# Altium schematic sheet USB_Hub.SchDoc: Apalis Evaluation Board 1.1
size A3; Organization: Toradex AG; Address1: Altsagenstrasse 5; Address2: Horw; Address3: 6048; Address4: Switzerland; DocumentNumber: 6; Revision: V1.1; SheetNumber: 6; SheetTotal: 32; PageSetup: Record=PageOptions|CenterHorizontal=True|CenterVertical=True|PrintScale=0.71|XCorrection=1.00|YCorrection=1.00|PrintKind=0|BorderSize=5000000|LeftOffset=0|BottomOffset=0|Orientation=2|PaperLength=1000|PaperWidth=1000|Scale=100|PaperSource=7|PrintQuality=-4|MediaType=1|DitherType=10|PaperKind=A4|PrintScaleMode=1
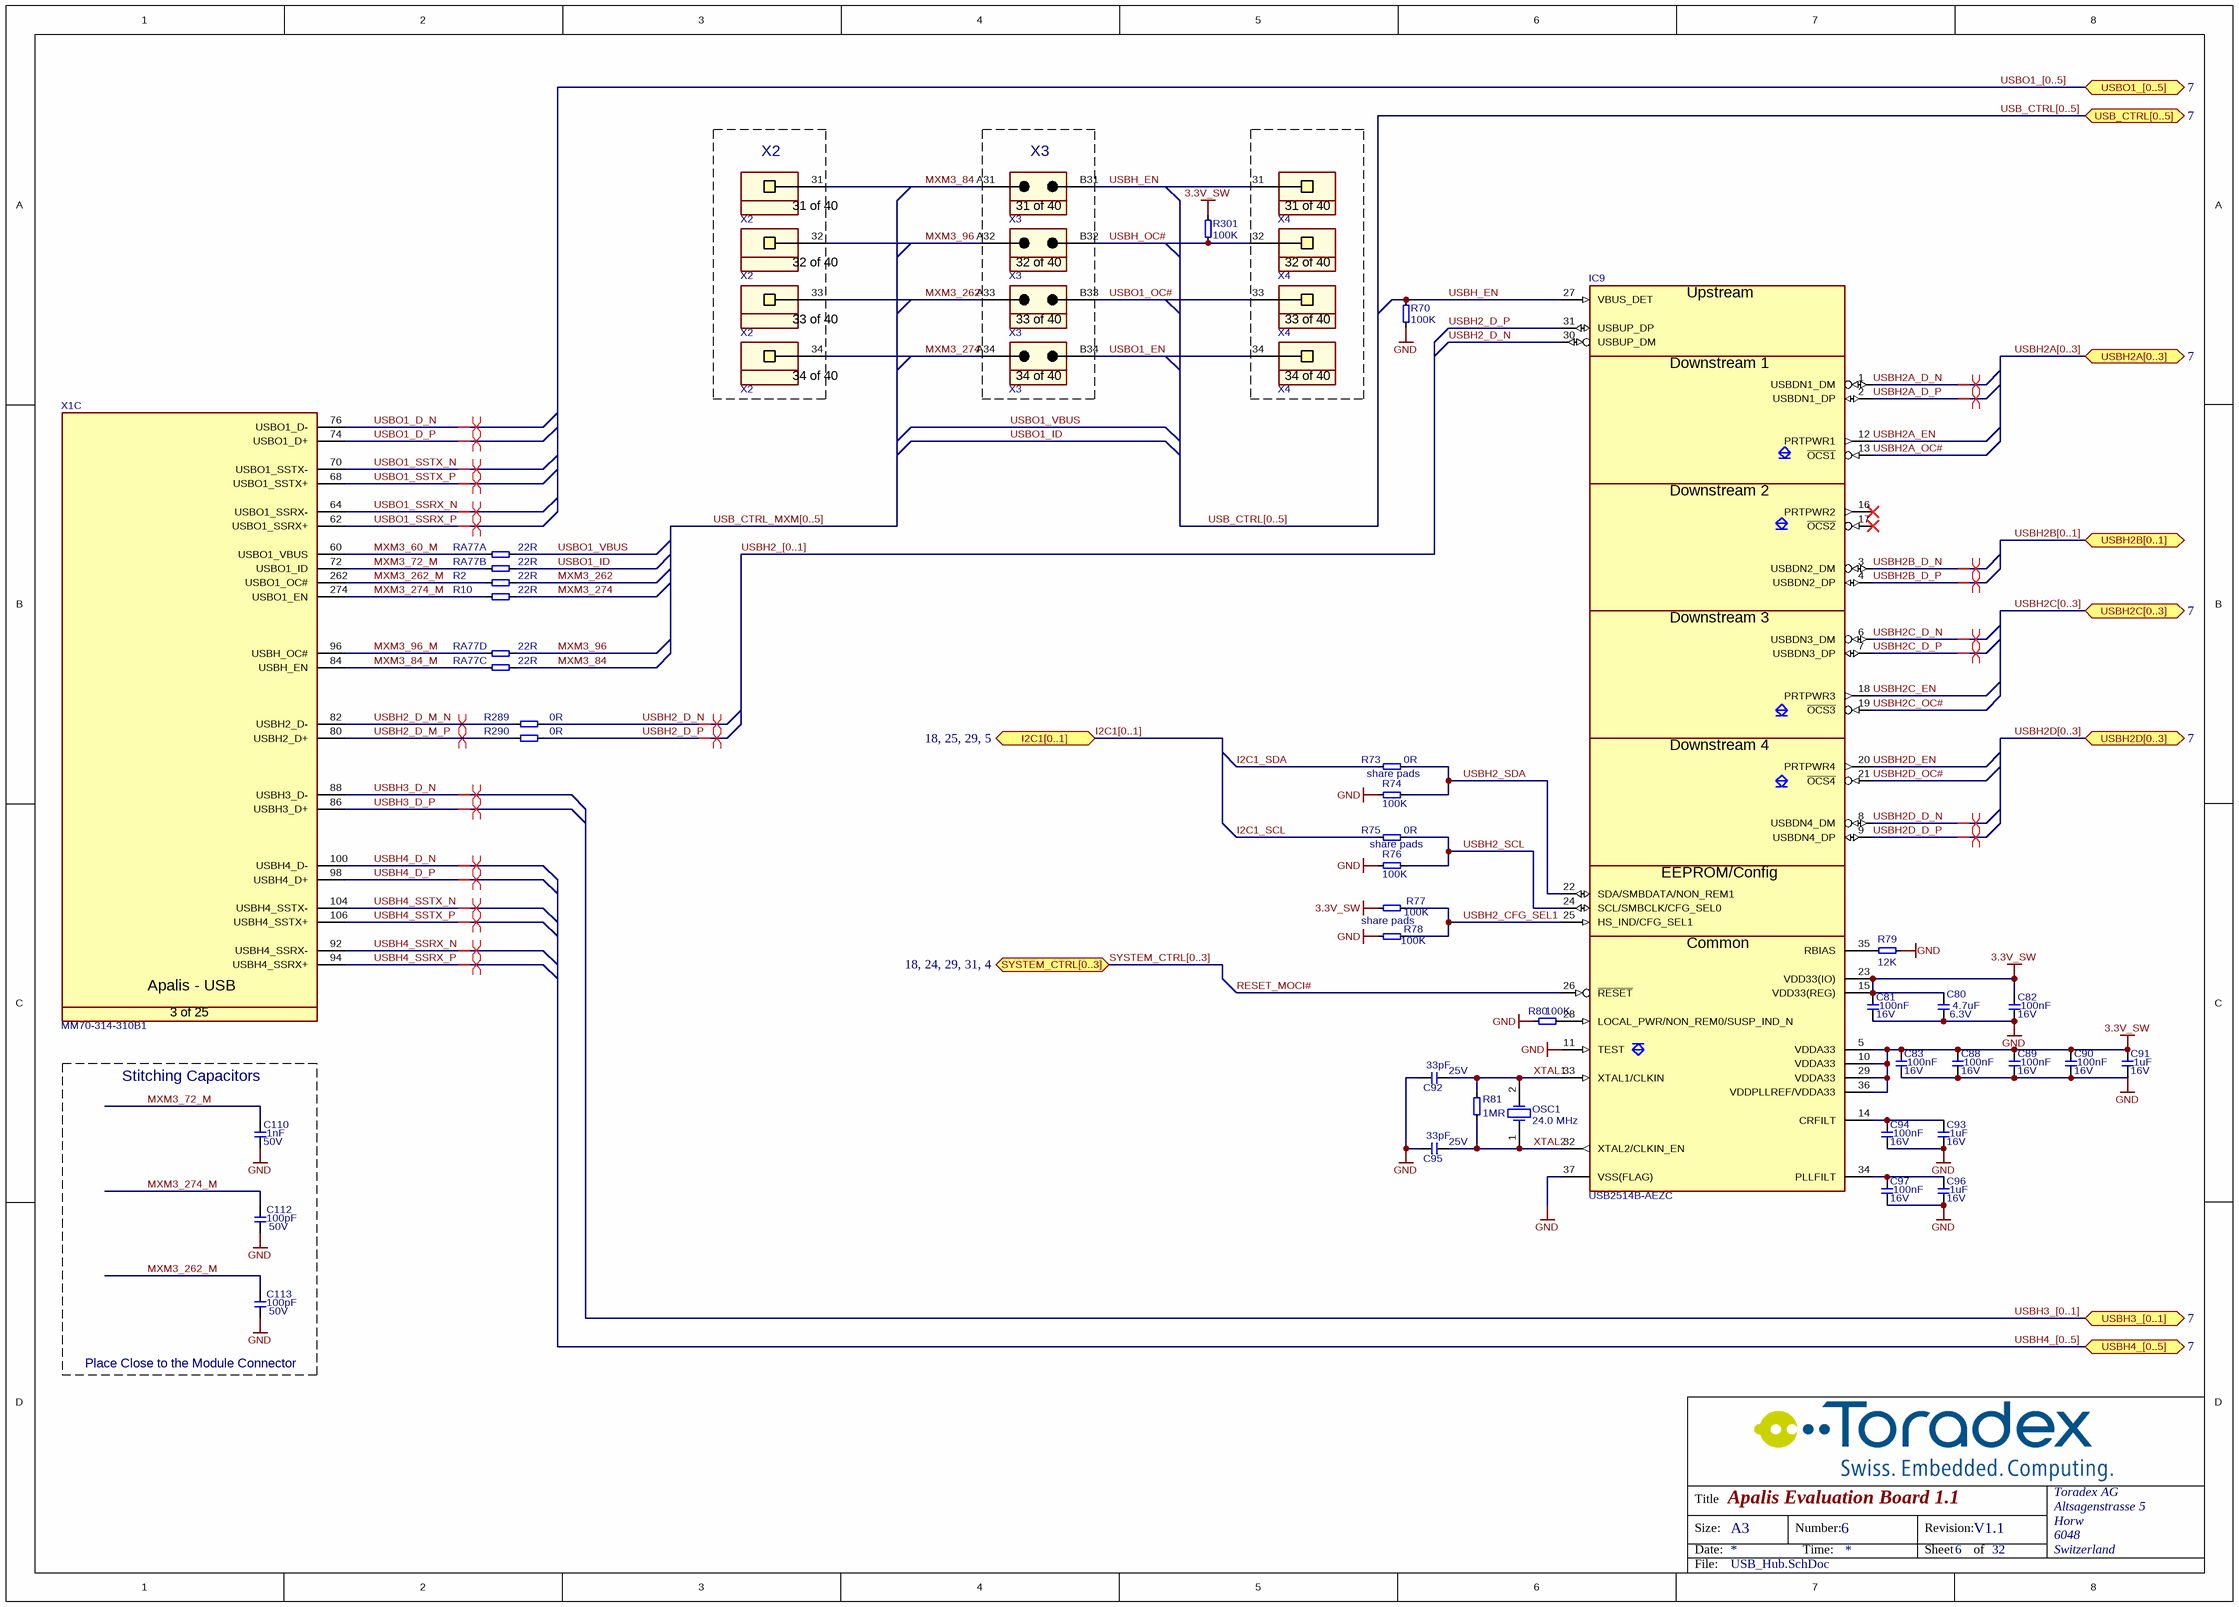
[diagram p0: USB_Hub.SchDoc]

## Parts
C80  Rating: 6.3V  [T_CAPC0603X33N]  (hidden comment: 4.7uF)
C81  Rating: 16V  [T_CAPC0603X33N]  (hidden comment: 100nF)
C82  Rating: 16V  [T_CAPC0603X33N]  (hidden comment: 100nF)
C83  Rating: 16V  [T_CAPC0603X33N]  (hidden comment: 100nF)
C88  Rating: 16V  [T_CAPC0603X33N]  (hidden comment: 100nF)
C89  Rating: 16V  [T_CAPC0603X33N]  (hidden comment: 100nF)
C90  Rating: 16V  [T_CAPC0603X33N]  (hidden comment: 100nF)
C91  Rating: 16V  [T_CAPC0603X33N]  (hidden comment: 1uF)
C92  Rating: 25V  [T_CAPC0603X33N]  (hidden comment: 33pF)
C93  Rating: 16V  [T_CAPC0603X33N]  (hidden comment: 1uF)
C94  Rating: 16V  [T_CAPC0603X33N]  (hidden comment: 100nF)
C95  Rating: 25V  [T_CAPC0603X33N]  (hidden comment: 33pF)
C96  Rating: 16V  [T_CAPC0603X33N]  (hidden comment: 1uF)
C97  Rating: 16V  [T_CAPC0603X33N]  (hidden comment: 100nF)
C110  Rating: 50V  [CAPC1005X60N]  (hidden comment: 1nF)
C112  Rating: 50V  [CAPC1005X60N]  (hidden comment: 100pF)
C113  Rating: 50V  [CAPC1005X60N]  (hidden comment: 100pF)
IC9  Manufacturer Part No.: USB2514B-AEZC  [T_SMSC_USB2514B-AEZC]  (hidden comment: USB2514B)
OSC1  value 24.0 MHz  [T_HORIZON-HEX24]  (hidden comment: HEX24-24000MHz-18-50R-F-H2-T2-W2-T)
R2  22R  [RESC1005X40N]
R10  22R  [RESC1005X40N]
R70  100K  [T_RESC0603X30N]
R73  0R  [T_RESC0603X30N]
R74  100K  [T_RESC0603X30N]
R75  0R  [T_RESC0603X30N]
R76  100K  [T_RESC0603X30N]
R77  100K  [T_RESC0603X30N]
R78  100K  [T_RESC0603X30N]
R79  12K  [T_RESC0603X30N]
R80  100K  [T_RESC0603X30N]
R81  1MR  [T_RESC0603X30N]
R289  0R  [RESC1005X40N]
R290  0R  [RESC1005X40N]
R301  100K  [T_RESC0603X30N]
RA77  22R  [T_Resistor_Array_X4]  (parts A,B,C,D of 4)
X1  Manufacturer Part No.: MM70-314-310B1  [T_JAE_MM70-314-310B1]  (hidden comment: CON-JAE-MM70-314-310B1-314-0.5mm)  (part C of 25)
X2  SSW-110-01-G-S  [T_Samtec_SSW-110-01-G-S]  (value not drawn)  (parts 31,32,33,34 of 40)
X3  TSW-110-07-G-D  [T_Samtec_TSW-110-07-G-D]  (value not drawn)  (parts 31,32,33,34 of 40)
X4  SSW-110-01-G-S  [T_Samtec_SSW-110-01-G-S]  (value not drawn)  (parts 31,32,33,34 of 40)

## Blocks framed on the sheet
X2: X2
X3: X3
Stitching Capacitors: C110 C112 C113

## Ports
I2C1[0..1] (bidir, see 18, 25, 29, 5), SYSTEM_CTRL[0..3] (bidir, see 18, 24, 29, 31, 4), USB_CTRL[0..5] (bidir, see 7), USBH2A[0..3] (bidir, see 7), USBH2B[0..1] (bidir), USBH2C[0..3] (bidir, see 7), USBH2D[0..3] (bidir, see 7), USBH3_[0..1] (bidir, see 7), USBH4_[0..5] (bidir, see 7), USBO1_[0..5] (bidir, see 7)

## Nets
3.3V_SW: C80.2 C81.2 C82.2 C83.2 C88.2 C89.2 C90.2 C91.2 IC9.5(VDDA33) IC9.10(VDDA33) IC9.15(VDD33(REG)) IC9.23(VDD33(IO)) IC9.29(VDDA33) IC9.36(VDDPLLREF/VDDA33) R77.2 R301.1
GND: C80.1 C81.1 C82.1 C83.1 C88.1 C89.1 C90.1 C91.1 C92.1 C93.1 C94.1 C95.1 C96.1 C97.1 C110.1 C112.1 C113.1 IC9.11(TEST) IC9.37(VSS(FLAG)) R70.1 R74.2 R76.2 R78.2 R79.1 R80.1
I2C1_SCL: R75.1
I2C1_SDA: R73.1
MXM3_60_M: RA77.1 X1.60(USBO1_VBUS)
MXM3_72_M: C110.2 RA77.2 X1.72(USBO1_ID)
MXM3_84: RA77.7 X2.31 X3.A31
MXM3_84_M: RA77.3 X1.84(USBH_EN)
MXM3_96: RA77.8 X2.32 X3.A32
MXM3_96_M: RA77.4 X1.96(USBH_OC#)
MXM3_262: R2.2 X2.33 X3.A33
MXM3_262_M: C113.2 R2.1 X1.262(USBO1_OC#)
MXM3_274: R10.2 X2.34 X3.A34
MXM3_274_M: C112.2 R10.1 X1.274(USBO1_EN)
RESET_MOCI#: IC9.26(~{RESET})
USBH2_CFG_SEL1: IC9.25(HS_IND/CFG_SEL1) R77.1 R78.1
USBH2_D_M_N: R289.1 X1.82(USBH2_D-)
USBH2_D_M_P: R290.1 X1.80(USBH2_D+)
USBH2_D_N: IC9.30(USBUP_DM) R289.2
USBH2_D_P: IC9.31(USBUP_DP) R290.2
USBH2_SCL: IC9.24(SCL/SMBCLK/CFG_SEL0) R75.2 R76.1
USBH2_SDA: IC9.22(SDA/SMBDATA/NON_REM1) R73.2 R74.1
USBH2A_D_N: IC9.1(USBDN1_DM)
USBH2A_D_P: IC9.2(USBDN1_DP)
USBH2A_EN: IC9.12(PRTPWR1)
USBH2A_OC#: IC9.13(~{OCS1})
USBH2B_D_N: IC9.3(USBDN2_DM)
USBH2B_D_P: IC9.4(USBDN2_DP)
USBH2C_D_N: IC9.6(USBDN3_DM)
USBH2C_D_P: IC9.7(USBDN3_DP)
USBH2C_EN: IC9.18(PRTPWR3)
USBH2C_OC#: IC9.19(~{OCS3})
USBH2D_D_N: IC9.8(USBDN4_DM)
USBH2D_D_P: IC9.9(USBDN4_DP)
USBH2D_EN: IC9.20(PRTPWR4)
USBH2D_OC#: IC9.21(~{OCS4})
USBH3_D_N: X1.88(USBH3_D-)
USBH3_D_P: X1.86(USBH3_D+)
USBH4_D_N: X1.100(USBH4_D-)
USBH4_D_P: X1.98(USBH4_D+)
USBH4_SSRX_N: X1.92(USBH4_SSRX-)
USBH4_SSRX_P: X1.94(USBH4_SSRX+)
USBH4_SSTX_N: X1.104(USBH4_SSTX-)
USBH4_SSTX_P: X1.106(USBH4_SSTX+)
USBH_EN: IC9.27(VBUS_DET) R70.2 X3.B31 X4.31
USBH_OC#: R301.2 X3.B32 X4.32
USBO1_D_N: X1.76(USBO1_D-)
USBO1_D_P: X1.74(USBO1_D+)
USBO1_EN: X3.B34 X4.34
USBO1_ID: RA77.6
USBO1_OC#: X3.B33 X4.33
USBO1_SSRX_N: X1.64(USBO1_SSRX-)
USBO1_SSRX_P: X1.62(USBO1_SSRX+)
USBO1_SSTX_N: X1.70(USBO1_SSTX-)
USBO1_SSTX_P: X1.68(USBO1_SSTX+)
USBO1_VBUS: RA77.5
XTAL1: C92.2 IC9.33(XTAL1/CLKIN) OSC1.2(OSC2) R81.2
XTAL2: C95.2 IC9.32(XTAL2/CLKIN_EN) OSC1.1(OSC1) R81.1
NetC93_2: C93.2 C94.2 IC9.14(CRFILT)
NetC96_2: C96.2 C97.2 IC9.34(PLLFILT)
NetIC9_28: IC9.28(LOCAL_PWR/NON_REM0/SUSP_IND_N) R80.2
NetIC9_35: IC9.35(RBIAS) R79.2

Not connected (* = marked no-connect by the designer): IC9 16(PRTPWR2)* 17(~{OCS2})*

## Buses and harness runs
bus I2C1[0..1] = port I2C1[0..1]
bus SYSTEM_CTRL[0..3] = port SYSTEM_CTRL[0..3]
bus USB_CTRL[0..5] = port USB_CTRL[0..5]
bus USB_CTRL_MXM[0..5]
bus USBH2_[0..1]
bus USBH2A[0..3] = port USBH2A[0..3]
bus USBH2B[0..1] = port USBH2B[0..1]
bus USBH2C[0..3] = port USBH2C[0..3]
bus USBH2D[0..3] = port USBH2D[0..3]
bus USBH3_[0..1] = port USBH3_[0..1]
bus USBH4_[0..5] = port USBH4_[0..5]
bus USBO1_[0..5] = port USBO1_[0..5]

## Layout directives
differential pair: USBH2_D_M_N, USBH2_D_M_P, USBH2_D_N, USBH2_D_P, USBH2A_D_N, USBH2A_D_P, USBH2B_D_N, USBH2B_D_P, USBH2C_D_N, USBH2C_D_P, USBH2D_D_N, USBH2D_D_P, USBH3_D_N, USBH3_D_P, USBH4_D_N, USBH4_D_P, USBH4_SSRX_N, USBH4_SSRX_P, USBH4_SSTX_N, USBH4_SSTX_P, USBO1_D_N, USBO1_D_P, USBO1_SSRX_N, USBO1_SSRX_P, USBO1_SSTX_N, USBO1_SSTX_P

## Notes on the sheet
- (near R73) share pads
- (near R75) share pads
- share pads
- (near C113) Place Close to the Module Connector
- Title
- Size:
- Date:
- A3
- Number:
- Time:
- Revision:
- Sheet
- of
- File:
- (in symbol CON-JAE-MM70-314-310B1-314-0.5mm, part C) Apalis - USB; 3 of 25
- (in symbol CON-Samtec-SSW-110-01-G-S, part 31) 31 of 40
- (in symbol CON-Samtec-SSW-110-01-G-S, part 32) 32 of 40
- (in symbol CON-Samtec-SSW-110-01-G-S, part 33) 33 of 40
- (in symbol CON-Samtec-SSW-110-01-G-S, part 34) 34 of 40
- (in symbol CON-Samtec-TSW-110-07-G-D, part 31) 31 of 40
- (in symbol CON-Samtec-TSW-110-07-G-D, part 32) 32 of 40
- (in symbol CON-Samtec-TSW-110-07-G-D, part 33) 33 of 40
- (in symbol CON-Samtec-TSW-110-07-G-D, part 34) 34 of 40
- (in symbol IC-SMSC-USB2514B-AEZC) Upstream; Downstream 1; Downstream 2; Downstream 3; Downstream 4; EEPROM/Config; Common

## Library data of the parts
C80 = C-X5R-4.7uF-6.3V-20%-0603: Capacitor Ceramic X5R 4.7uF 6.3V 20% 0603; Tolerance: 20%; Type: X5R; Value: 4.7uF
C81-C83 C88-C90 C94 C97 = C-X7R-100nF-16V-10%-0603: Capacitor Ceramic X7R 100nF 16V 10% 0603; Tolerance: 10%; Type: X7R; Value: 100nF
C91 C93 C96 = C-X5R-1uF-16V-20%-0603: Capacitor Ceramic X5R 1uF 16V 20% 0603; Tolerance: 20%; Type: X5R; Value: 1uF
C92 C95 = C-NP0-33pF-25V-10%-0603: Capacitor Ceramic NP0 33pF 25V 10% 0603; Tolerance: 10%; Type: NP0; Value: 33pF
C110 = C-X7R-1nF-50V-10%-0402: Capacitor Ceramic X7R 1nF 50V 10% 0402; Tolerance: 10%; Type: X7R; Value: 1nF
C112 C113 = C-X7R-100pF-50V-10%-0402: Capacitor Ceramic X7R 100pF 50V 10% 0402; Tolerance: 10%; Type: X7R; Value: 100pF
IC9 = IC-SMSC-USB2514B-AEZC: 4 Port USB HUB; Manufacturer Name: SMSC
OSC1 = OSC-HORIZON-HEX24-24000MHz-18-50R-F-H2-T2-W2-T: Quartz 24.0 MHz; Tolerance: 30ppm; Manufacturer Name: HORIZON; Manufacturer Part No.: HEX24-24000MHz-18-50R-F-H2-T2-W2-T
R2 R10 = R-22R-63mW-5%-0402: Resistor 22 ohm 63mW 5% 0402; Rating: 63mW; Tolerance: 5%; Value: 22R
R70 R74 R76-R78 R80 R301 = R-100KR-63mW-5%-0603: Resistor 100 Kohm 63mW 5% 0603; Value: 100KR; Rating: 63mW; Tolerance: 5%
R73 R75 = R-0R-63mW-1%-0603: Resistor 0 ohm 63mW 1% 0603; Rating: 63mW; Tolerance: 1%; Value: 0R
R79 = R-12KR-63mW-1%-0603: Resistor 12 Kohm 63mW 1% 0603; Value: 12KR; Rating: 63mW; Tolerance: 1%
R81 = R-1MR-63mW-5%-0603: Resistor 1Mohm 63mW 5% 0603; Rating: 63mW; Tolerance: 5%; Value: 1MR
R289 R290 = R-0R-63mW-1%-0402: Resistor 0 ohm 63mW 1% 0402; Rating: 63mW; Tolerance: 1%; Value: 0R
RA77 = RA-22R-63mW-5%-1206-div: Resistor Array 22 R 63mW 5% 1206; Tolerance: 5%; Power Dissipation: 63mW; Value: 22R
X1 = CON-JAE-MM70-314-310B1-314-0.5mm: MXM3 Connector; Manufacturer Name: JAE; No. of ways: 314
X2 X4 = CON-Samtec-SSW-110-01-G-S: Receptacle Female Socket 1x40 pin 2.54mm pitch; Manufacturer Name: Samtec; Pitch: 2.54mm; No. of ways: 1x40; Manufacturer Part No.: SSW-110-01-G-S
X3 = CON-Samtec-TSW-110-07-G-D: Header 2x40 pin 2.54mm pitch; Manufacturer Name: Samtec; Pitch: 2.54mm; No. of ways: 2x40; Manufacturer Part No.: TSW-110-07-G-D